# EAGLE schematic MotorShield (EAGLE 9.0.1)

## Sheet 1 of 2
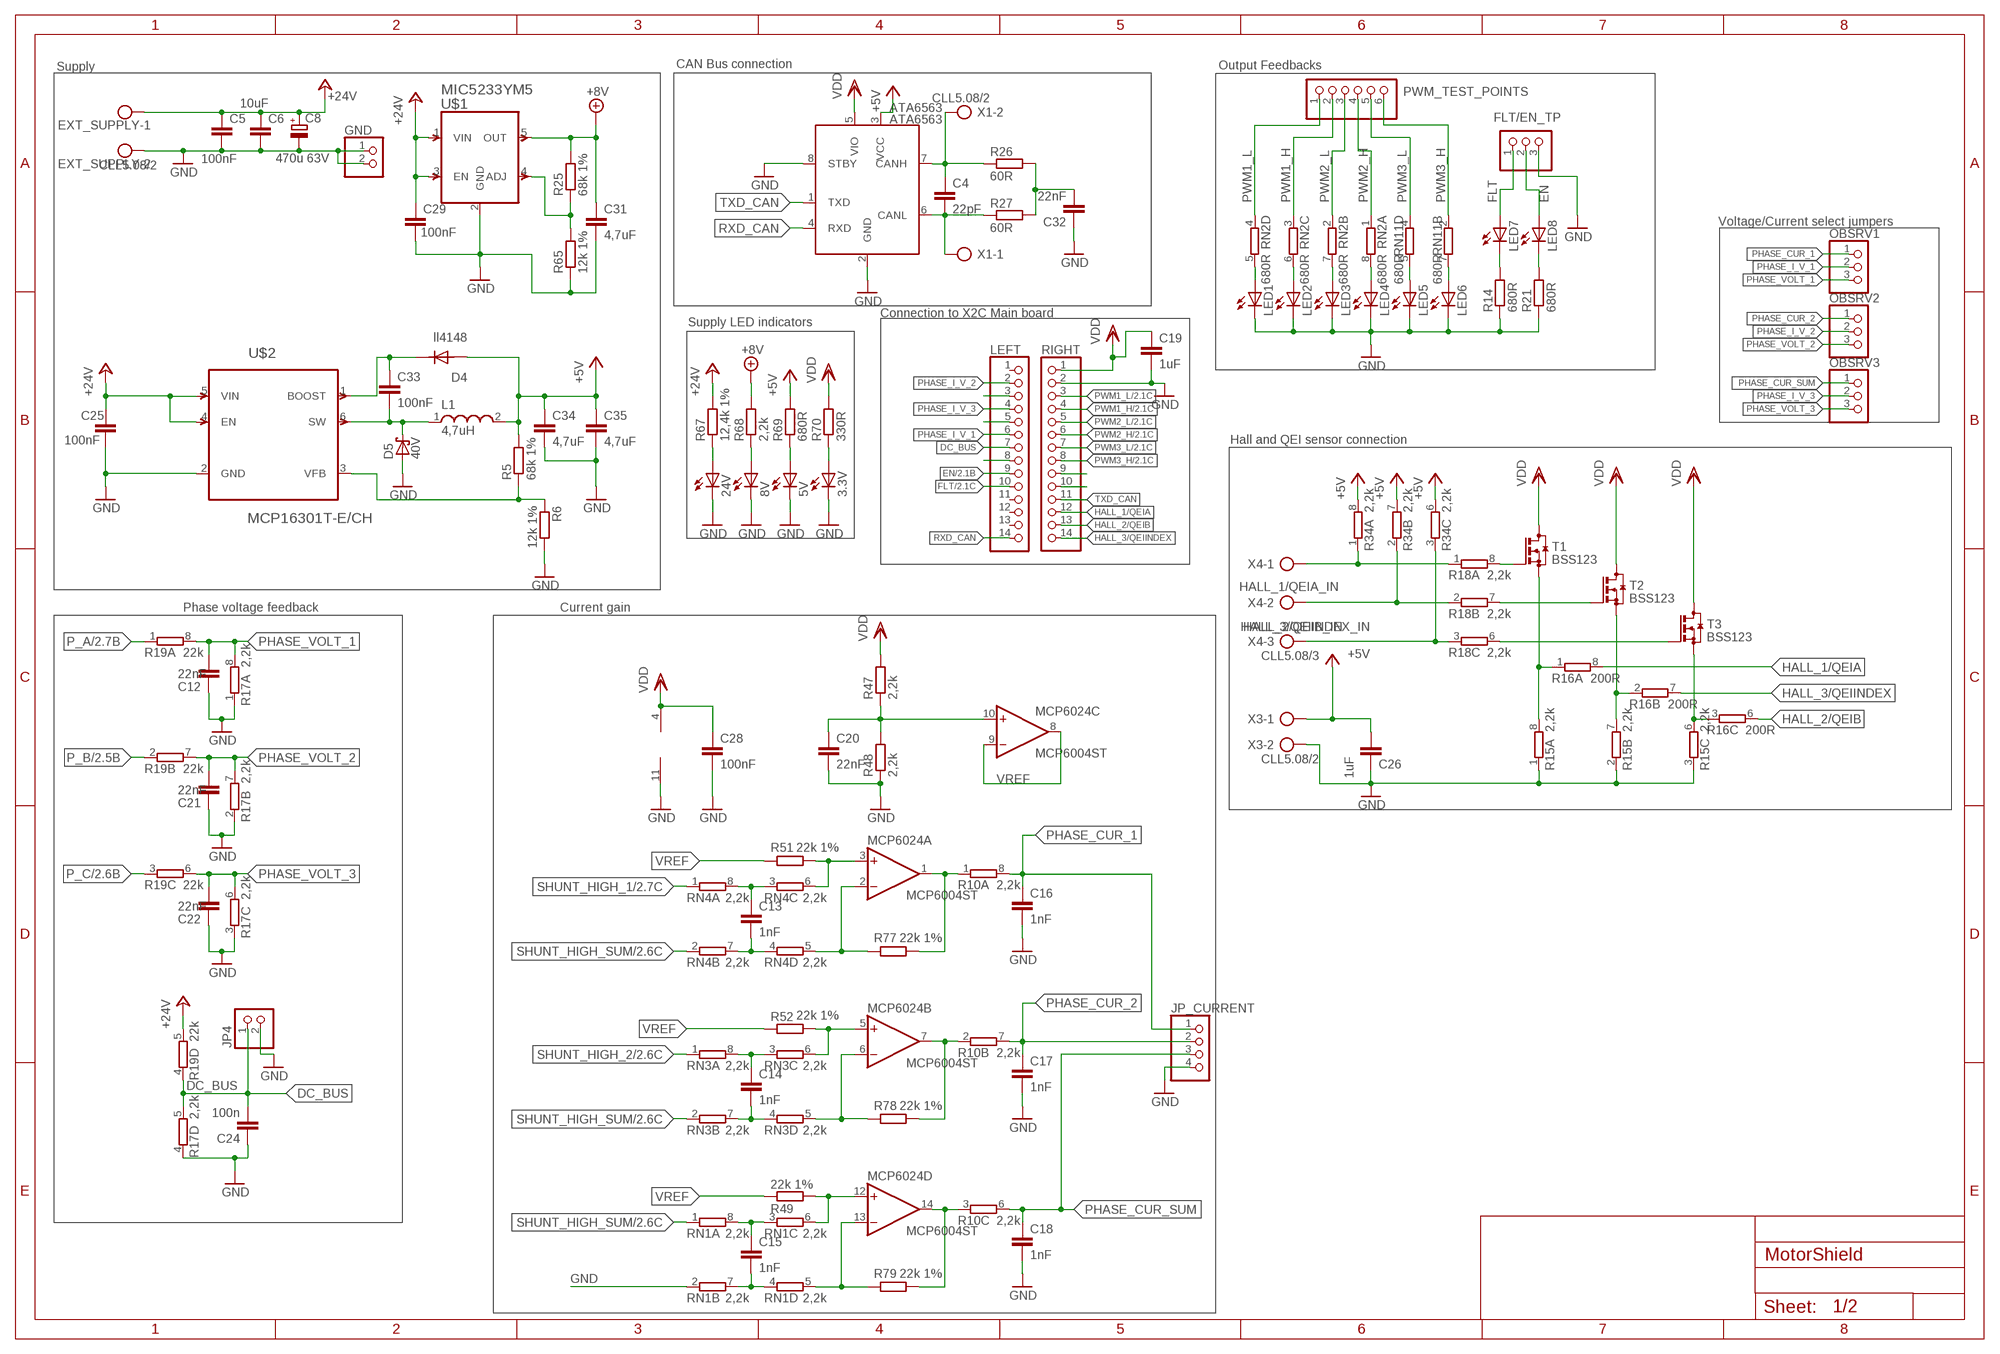
[diagram p0: schematic, sheet 1]

### Parts
3.3V  Green  LEDCHIPLED_0805_GREEN  [CHIPLED_0805]
5V  Green  LEDCHIPLED_0805_GREEN  [CHIPLED_0805]
8V  Green  LEDCHIPLED_0805_GREEN  [CHIPLED_0805]
24V  Green  LEDCHIPLED_0805_GREEN  [CHIPLED_0805]
ATA6563  ATA6563  [SOIC-8]
C4  22pF  C-EU-SMD_0603_22PF_50V  [C0603K]
C5  100nF  C-EU-SMD_0603_100NF_50V  [C0603K]
C6  10uF  C-EU-SMD_1206_10UF_50V  [C1206]
C8  470u 63V  CPOL-EUE  [PANASONIC_E]
C12  22nF  C-EU-SMD_0603_22NF_16V  [C0603K]
C13  1nF  C-EU-SMD_0603_1NF_100V  [C0603K]
C14  1nF  C-EU-SMD_0603_1NF_100V  [C0603K]
C15  1nF  C-EU-SMD_0603_1NF_100V  [C0603K]
C16  1nF  C-EU-SMD_0603_1NF_100V  [C0603K]
C17  1nF  C-EU-SMD_0603_1NF_100V  [C0603K]
C18  1nF  C-EU-SMD_0603_1NF_100V  [C0603K]
C19  1uF  C-EU-SMD_0603_1UF_10V  [C0603K]
C20  22nF  C-EU-SMD_0603_22NF_16V  [C0603K]
C21  22nF  C-EU-SMD_0603_22NF_16V  [C0603K]
C22  22nF  C-EU-SMD_0603_22NF_16V  [C0603K]
C24  100n  C-EUC0805  [C0805]
C25  100nF  C-EU-SMD_0603_100NF_50V  [C0603K]
C26  1uF  C-EU-SMD_0603_1UF_10V  [C0603K]
C28  100nF  C-EU-SMD_0603_100NF_50V  [C0603K]
C29  100nF  C-EU-SMD_0603_100NF_50V  [C0603K]
C31  4,7uF  C-EU-SMD_0603_4,7UF_16V  [C0603K]
C32  22nF  C-EU-SMD_0603_22NF_16V  [C0603K]
C33  100nF  C-EU-SMD_0603_100NF_50V  [C0603K]
C34  4,7uF  C-EU-SMD_0603_4,7UF_16V  [C0603K]
C35  4,7uF  C-EU-SMD_0603_4,7UF_16V  [C0603K]
D4  ll4148  1N4148MINIMELF  [MINIMELF]
D5  40V  SCHOTTKY40V  [MINIMELF]
EXT_SUPPLY  CLL5.08/2  AK500/2CSAVAROS_CLL5.08/2  [CLL5.08/2]
FLT/EN_TP  PINHD-1X3  [1X03]
GND  PINHD-1X2  [1X02]
JP4  PINHD-1X2  [1X02]
JP_CURRENT  PINHD-1X4  [1X04]
L1  4,7uH  WE-TPC_3816_4,7UH_0,9A  [WE-TPC_3816]
LED1  Yellow  LEDCHIPLED_0805_YELLOW  [CHIPLED_0805]
LED2  Yellow  LEDCHIPLED_0805_YELLOW  [CHIPLED_0805]
LED3  Yellow  LEDCHIPLED_0805_YELLOW  [CHIPLED_0805]
LED4  Yellow  LEDCHIPLED_0805_YELLOW  [CHIPLED_0805]
LED5  Yellow  LEDCHIPLED_0805_YELLOW  [CHIPLED_0805]
LED6  Yellow  LEDCHIPLED_0805_YELLOW  [CHIPLED_0805]
LED7  Red  LEDCHIPLED_0805_RED  [CHIPLED_0805]
LED8  Red  LEDCHIPLED_0805_RED  [CHIPLED_0805]
LEFT  PINHD-1X14  [1X14]
MCP6024  MCP6004ST  [TSSOP14]
OBSRV1  PINHD-1X3  [1X03]
OBSRV2  PINHD-1X3  [1X03]
OBSRV3  PINHD-1X3  [1X03]
PWM_TEST_POINTS  PINHD-1X6  [1X06]
R5  68k 1%  R-EU_SMDR0603_68K_1%  [R0603]
R6  12k 1%  R-EU_SMDR0603_12K_1%  [R0603]
R10  2,2k  4R-N2,2K  [EXBV8V_A]
R14  680R  R-EU_SMDR0603_680R  [R0603]
R15  2,2k  4R-N2,2K  [EXBV8V_A]
R16  200R  4R-N200R  [EXBV8V_A]
R17  2,2k  4R-N2,2K  [EXBV8V_A]
R18  2,2k  4R-N2,2K  [EXBV8V_A]
R19  22k  4R-N22K  [EXBV8V_A]
R21  680R  R-EU_SMDR0603_680R  [R0603]
R25  68k 1%  R-EU_SMDR0603_68K_1%  [R0603]
R26  60R  R-EU_SMDR1206_60R  [R1206]
R27  60R  R-EU_SMDR1206_60R  [R1206]
R34  2,2k  4R-N2,2K  [EXBV8V_A]
R47  2,2k  R-EU_SMDR0603_2,2K  [R0603]
R48  2,2k  R-EU_SMDR0603_2,2K  [R0603]
R49  22k 1%  R-EU_SMDR0603_22K_1%  [R0603]
R51  22k 1%  R-EU_SMDR0603_22K_1%  [R0603]
R52  22k 1%  R-EU_SMDR0603_22K_1%  [R0603]
R65  12k 1%  R-EU_SMDR0603_12K_1%  [R0603]
R67  12,4k 1%  R-EU_SMDR0603_12,4K_1%  [R0603]
R68  2,2k  R-EU_SMDR0603_2,2K  [R0603]
R69  680R  R-EU_SMDR0603_680R  [R0603]
R70  330R  R-EU_SMDR0603_330R  [R0603]
R77  22k 1%  R-EU_SMDR0603_22K_1%  [R0603]
R78  22k 1%  R-EU_SMDR0603_22K_1%  [R0603]
R79  22k 1%  R-EU_SMDR0603_22K_1%  [R0603]
RIGHT  PINHD-1X14  [1X14]
RN1  2,2k  4R-N2,2K  [EXBV8V_A]
RN2  680R  4R-N680R  [EXBV8V_A]
RN3  2,2k  4R-N2,2K  [EXBV8V_A]
RN4  2,2k  4R-N2,2K  [EXBV8V_A]
RN11  680R  4R-N680R  [EXBV8V_A]
T1  BSS123  [SOT23]
T2  BSS123  [SOT23]
T3  BSS123  [SOT23]
U$1  MIC5233YM5  [TSOT23-5]
U$2  MCP16301T-E/CH  [SOT23-6]
X1  CLL5.08/2  AK500/2CSAVAROS_CLL5.08/2  [CLL5.08/2]
X3  CLL5.08/2  AK500/2CSAVAROS_CLL5.08/2  [CLL5.08/2]
X4  CLL5.08/3  AK500/3CSAVAROS_CLL5.08/3  [CLL5.08/3]

### Nets
+5V: ATA6563.3(VCC) C26.1 C34.1 C35.1 D4.A L1.2 R5.2 R34.6 R34.7 R34.8 R69.2 X3.1
+8V: C31.1 R25.2 R68.2 U$1.5(OUT) ; also sheet 2
+24V: C5.1 C6.1 C8.+ C25.1 C29.1 EXT_SUPPLY.1 R19.5 R67.2 U$1.1(VIN) U$1.3(EN) U$2.4(EN) U$2.5(VIN) ; also sheet 2
CAN_H: ATA6563.7(CANH) C4.1 R26.1 X1.2
CAN_L: ATA6563.6(CANL) C4.2 R27.1 X1.1
DC_BUS: C24.2 JP4.1 LEFT.7 R17.5 R19.4
EN: FLT/EN_TP.2 LED8.A LEFT.9 ; also sheet 2
FLT: FLT/EN_TP.1 LED7.A LEFT.10 ; also sheet 2
GND: 3.3V.C 5V.C 8V.C 24V.C ATA6563.2(GND) ATA6563.8(STBY) C5.2 C6.2 C8.- C12.2 C16.2 C17.2 C18.2 C19.2 C20.2 C21.2 C22.2 C24.1 C25.2 C26.2 C28.2 C29.2 C31.2 C32.1 C34.2 C35.2 D5.A EXT_SUPPLY.2 FLT/EN_TP.3 GND.1 GND.2 JP4.2 JP_CURRENT.4 LED1.C LED2.C LED3.C LED4.C LED5.C LED6.C MCP6024.11(P:V-) R6.2 R14.1 R15.1 R15.2 R15.3 R17.1 R17.2 R17.3 R17.4 R21.1 R48.1 R65.1 RIGHT.2 RN1.2 U$1.2(GND) U$2.2(GND) X3.2 ; also sheet 2
HALL_1/QEIA: R16.8 RIGHT.12
HALL_1/QEIA_IN: R18.1 R34.1 X4.1
HALL_2/QEIB: R16.6 RIGHT.13
HALL_2/QEIB_IN: R18.3 R34.3 X4.3
HALL_3/QEIINDEX: R16.7 RIGHT.14
HALL_3/QEIINDEX_IN: R18.2 R34.2 X4.2
N$2: MCP6024.3(A:+IN) R51.2 RN4.6
N$3: MCP6024.14(D:OUT) R10.3 R79.2
N$4: MCP6024.7(B:OUT) R10.2 R78.2
N$5: LEFT.3
N$6: LED8.C R21.2
N$7: LEFT.5
N$8: LED7.C R14.2
N$9: MCP6024.5(B:+IN) R52.2 RN3.6
N$10: RIGHT.9
N$11: RIGHT.10
N$12: C33.2 D5.C L1.1 U$2.6(SW)
N$13: LEFT.8
N$14: R25.1 R65.2 U$1.4(ADJ)
N$15: MCP6024.12(D:+IN) R49.2 RN1.6
N$16: R15.6 R16.3 T3.2(S)
N$17: R15.7 R16.2 T2.2(S)
N$18: R15.8 R16.1 T1.2(S)
N$19: R18.8 T1.1(G)
N$20: R18.7 T2.1(G)
N$23: R18.6 T3.1(G)
N$24: LED4.A RN2.8
N$25: LED3.A RN2.7
N$26: LED2.A RN2.6
N$27: 24V.A R67.1
N$28: 8V.A R68.1
N$30: 5V.A R69.1
N$31: 3.3V.A R70.1
N$33: C13.2 RN4.4 RN4.7
N$34: C13.1 RN4.3 RN4.8
N$35: MCP6024.2(A:-IN) R77.1 RN4.5
N$36: LED1.A RN2.5
N$37: C14.2 RN3.4 RN3.7
N$38: C14.1 RN3.3 RN3.8
N$39: LED5.A RN11.5
N$40: LED6.A RN11.7
N$44: R5.1 R6.1 U$2.3(VFB)
N$45: MCP6024.6(B:-IN) R78.1 RN3.5
N$47: C15.2 RN1.4 RN1.7
N$48: C15.1 RN1.3 RN1.8
N$49: MCP6024.13(D:-IN) R79.1 RN1.5
N$52: C33.1 D4.C U$2.1(BOOST)
N$56: C32.2 R26.2 R27.2
N$60: MCP6024.1(A:OUT) R10.1 R77.2
N$66: C20.1 MCP6024.10(C:+IN) R47.1 R48.2
P_A: R19.1 ; also sheet 2
P_B: R19.2 ; also sheet 2
P_C: R19.3 ; also sheet 2
PHASE_CUR_1: C16.1 JP_CURRENT.1 OBSRV1.1 R10.8
PHASE_CUR_2: C17.1 JP_CURRENT.2 OBSRV2.1 R10.7
PHASE_CUR_SUM: C18.1 JP_CURRENT.3 OBSRV3.1 R10.6
PHASE_I_V_1: LEFT.6 OBSRV1.2
PHASE_I_V_2: LEFT.2 OBSRV2.2
PHASE_I_V_3: LEFT.4 OBSRV3.2
PHASE_VOLT_1: C12.1 OBSRV1.3 R17.8 R19.8
PHASE_VOLT_2: C21.1 OBSRV2.3 R17.7 R19.7
PHASE_VOLT_3: C22.1 OBSRV3.3 R17.6 R19.6
PWM1_H: PWM_TEST_POINTS.2 RIGHT.4 RN2.3 ; also sheet 2
PWM1_L: PWM_TEST_POINTS.1 RIGHT.3 RN2.4 ; also sheet 2
PWM2_H: PWM_TEST_POINTS.4 RIGHT.6 RN2.1 ; also sheet 2
PWM2_L: PWM_TEST_POINTS.3 RIGHT.5 RN2.2 ; also sheet 2
PWM3_H: PWM_TEST_POINTS.6 RIGHT.8 RN11.2 ; also sheet 2
PWM3_L: PWM_TEST_POINTS.5 RIGHT.7 RN11.4 ; also sheet 2
RXD_CAN: ATA6563.4(RXD) LEFT.14
SHUNT_HIGH_1: RN4.1 ; also sheet 2
SHUNT_HIGH_2: RN3.1 ; also sheet 2
SHUNT_HIGH_SUM: RN1.1 RN3.2 RN4.2 ; also sheet 2
TXD_CAN: ATA6563.1(TXD) RIGHT.11
VDD: ATA6563.5(VIO) C19.1 C28.1 MCP6024.4(P:V+) R47.2 R70.2 RIGHT.1 T1.3(D) T2.3(D) T3.3(D) ; also sheet 2
VREF: MCP6024.8(C:OUT) MCP6024.9(C:-IN) R49.1 R51.1 R52.1
Unconnected: LEFT.1 LEFT.11 LEFT.12 LEFT.13 R10.4 R10.5 R15.4 R15.5 R16.4 R16.5 R18.4 R18.5 R34.4 R34.5 RN11.1 RN11.3 RN11.6 RN11.8

### Notes on the sheet
- Supply | CAN Bus connection | Output Feedbacks
- Voltage/Current select jumpers
- Connection to X2C Main board
- Supply LED indicators
- Hall and QEI sensor connection
- Phase voltage feedback | Current gain

## Sheet 2 of 2
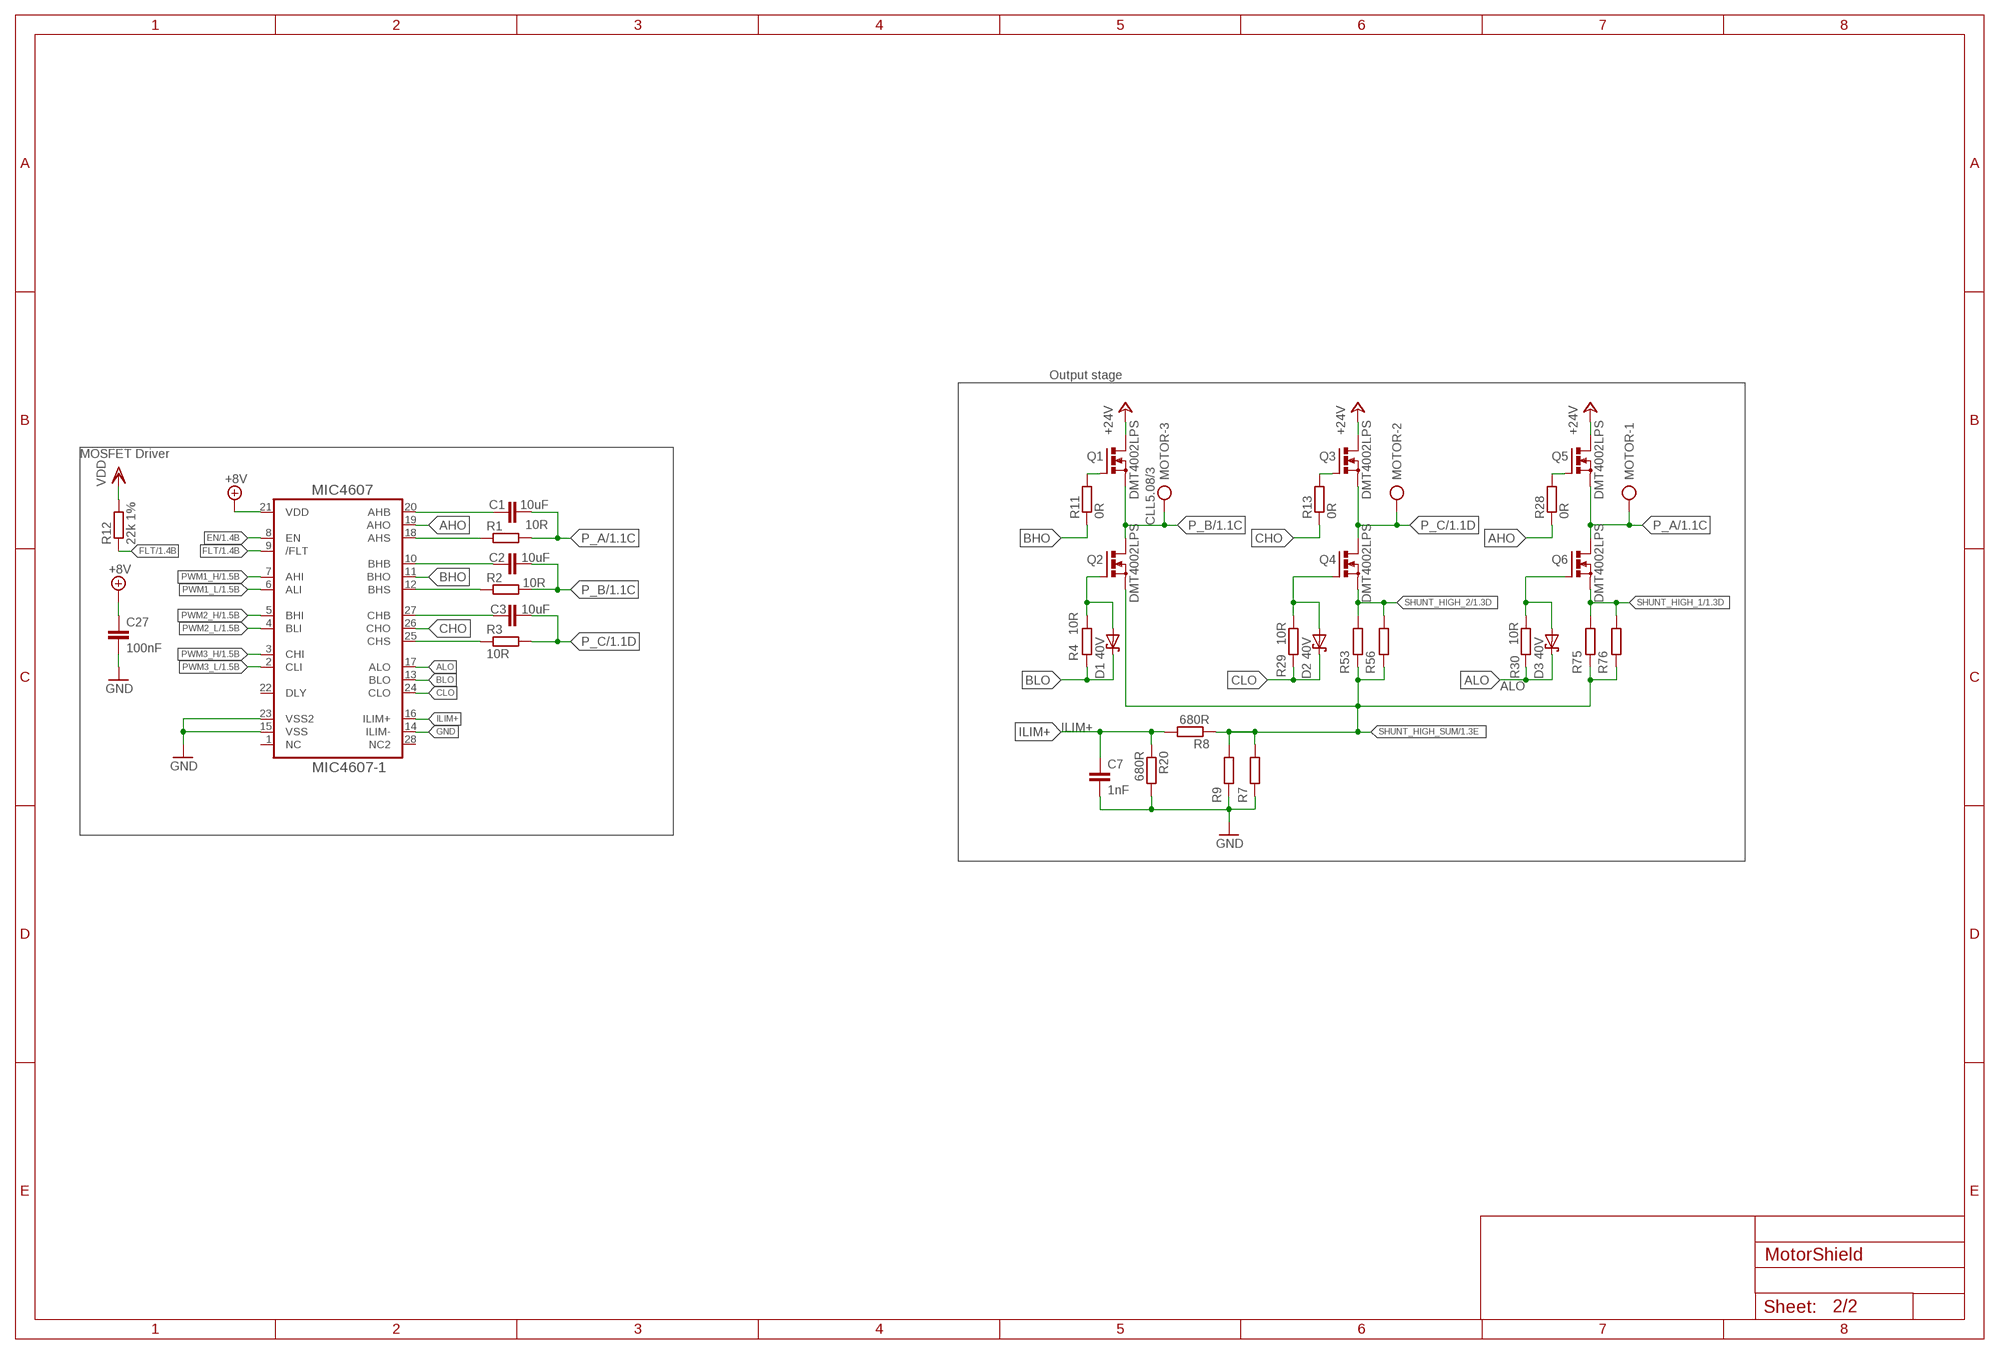
[diagram p1: schematic, sheet 2]

### Parts
C1  10uF  C-EU-SMD_0805_10UF_16V  [C0805K]
C2  10uF  C-EU-SMD_0805_10UF_16V  [C0805K]
C3  10uF  C-EU-SMD_0805_10UF_16V  [C0805K]
C7  1nF  C-EU-SMD_0603_1NF_100V  [C0603K]
C27  100nF  C-EU-SMD_0603_100NF_50V  [C0603K]
D1  40V  SCHOTTKY40V  [MINIMELF]
D2  40V  SCHOTTKY40V  [MINIMELF]
D3  40V  SCHOTTKY40V  [MINIMELF]
MIC4607  MIC4607-1  [TSSOP28]
MOTOR  CLL5.08/3  AK500/3CSAVAROS_CLL5.08/3  [CLL5.08/3]
Q1  DMT4002LPS  BSZ105N04NS_PG-TDSON-8  [PG-TDSON-8_]
Q2  DMT4002LPS  BSZ105N04NS_PG-TDSON-8  [PG-TDSON-8_]
Q3  DMT4002LPS  BSZ105N04NS_PG-TDSON-8  [PG-TDSON-8_]
Q4  DMT4002LPS  BSZ105N04NS_PG-TDSON-8  [PG-TDSON-8_]
Q5  DMT4002LPS  BSZ105N04NS_PG-TDSON-8  [PG-TDSON-8_]
Q6  DMT4002LPS  BSZ105N04NS_PG-TDSON-8  [PG-TDSON-8_]
R1  10R  R-EU_SMDR0603_3R  [R0603]
R2  10R  R-EU_SMDR0603_3R  [R0603]
R3  10R  R-EU_SMDR0603_3R  [R0603]
R4  10R  R-EU_SMDR0603_3R  [R0603]
R7  R-EU_SMDR2512  [R2512]
R8  680R  R-EU_SMDR0603_680R  [R0603]
R9  R-EU_SMDR2512  [R2512]
R11  0R  R-EU_SMDR0603_0R  [R0603]
R12  22k 1%  R-EU_SMDR0603_22K_1%  [R0603]
R13  0R  R-EU_SMDR0603_0R  [R0603]
R20  680R  R-EU_SMDR0603_680R  [R0603]
R28  0R  R-EU_SMDR0603_0R  [R0603]
R29  10R  R-EU_SMDR0603_3R  [R0603]
R30  10R  R-EU_SMDR0603_3R  [R0603]
R53  R-EU_SMDR2512  [R2512]
R56  R-EU_SMDR2512  [R2512]
R75  R-EU_SMDR2512  [R2512]
R76  R-EU_SMDR2512  [R2512]

### Nets
+8V: C27.1 MIC4607.21(VDD) ; also sheet 1
+24V: Q1.5(D) Q1.6(D) Q1.7(D) Q1.8(D) Q1.TH(D) Q3.5(D) Q3.6(D) Q3.7(D) Q3.8(D) Q3.TH(D) Q5.5(D) Q5.6(D) Q5.7(D) Q5.8(D) Q5.TH(D) ; also sheet 1
AHB: C1.1 MIC4607.20(AHB)
AHO: MIC4607.19(AHO) R28.1
AHS: MIC4607.18(AHS) R1.1
ALO: D3.C MIC4607.17(ALO) R30.2
BHB: C2.1 MIC4607.10(BHB)
BHO: MIC4607.11(BHO) R11.1
BHS: MIC4607.12(BHS) R2.1
BLO: D1.C MIC4607.13(BLO) R4.1
CHB: C3.1 MIC4607.27(CHB)
CHO: MIC4607.26(CHO) R13.1
CHS: MIC4607.25(CHS) R3.1
CLO: D2.C MIC4607.24(CLO) R29.2
EN: MIC4607.8(EN) ; also sheet 1
FLT: MIC4607.9(/FLT) R12.1 ; also sheet 1
GND: C7.2 C27.2 MIC4607.14(ILIM-) MIC4607.15(VSS) MIC4607.23(VSS2) R7.1 R9.1 R20.2 ; also sheet 1
ILIM+: C7.1 MIC4607.16(ILIM+) R8.2 R20.1
N$1: Q1.4(G) R11.2
N$21: Q3.4(G) R13.2
N$22: Q5.4(G) R28.2
N$29: D1.A Q2.4(G) R4.2
N$32: D2.A Q4.4(G) R29.1
N$58: D3.A Q6.4(G) R30.1
P_A: C1.2 MOTOR.1 Q5.1(S) Q5.2(S) Q5.3(S) Q6.5(D) Q6.6(D) Q6.7(D) Q6.8(D) Q6.TH(D) R1.2 ; also sheet 1
P_B: C2.2 MOTOR.3 Q1.1(S) Q1.2(S) Q1.3(S) Q2.5(D) Q2.6(D) Q2.7(D) Q2.8(D) Q2.TH(D) R2.2 ; also sheet 1
P_C: C3.2 MOTOR.2 Q3.1(S) Q3.2(S) Q3.3(S) Q4.5(D) Q4.6(D) Q4.7(D) Q4.8(D) Q4.TH(D) R3.2 ; also sheet 1
PWM1_H: MIC4607.7(AHI) ; also sheet 1
PWM1_L: MIC4607.6(ALI) ; also sheet 1
PWM2_H: MIC4607.5(BHI) ; also sheet 1
PWM2_L: MIC4607.4(BLI) ; also sheet 1
PWM3_H: MIC4607.3(CHI) ; also sheet 1
PWM3_L: MIC4607.2(CLI) ; also sheet 1
SHUNT_HIGH_1: Q6.1(S) Q6.2(S) Q6.3(S) R75.2 R76.2 ; also sheet 1
SHUNT_HIGH_2: Q4.1(S) Q4.2(S) Q4.3(S) R53.2 R56.2 ; also sheet 1
SHUNT_HIGH_SUM: Q2.1(S) Q2.2(S) Q2.3(S) R7.2 R8.1 R9.2 R53.1 R56.1 R75.1 R76.1 ; also sheet 1
VDD: R12.2 ; also sheet 1
Unconnected: MIC4607.1(NC) MIC4607.22(DLY) MIC4607.28(NC2)

### Notes on the sheet
- Output stage
- MOSFET Driver

## Library data of the parts
3.3V 5V 8V 24V = Diodes:LED: LED OSRAM: - CHIPLED LG R971, LG N971, LY N971, LG Q971, LY Q971, LO R971, LY R971 LH N974, LH R974 LS Q976, LO Q976, LY Q976 LO Q996 - Hyper CHIPLED LW Q18S LB Q993, LB Q99A, LB R99A - SideLED LS A670, LO A670, LY A670, LG A670, LP A670 LB A673, LV A673, LT A673, LW A673 LH A674 LY A675 LS A676, LA A676, LO A676, LY A676, LW A676 LS A679, LY A679, LG A679 - Hyper Micro SIDELED® LS Y876, LA Y876, LO Y876, LY Y876 LT Y87S - SmartLED LW L88C, LW L88S LB L89C, LB L89S, LG L890 LS L89K, LO L89K, LY L89K LS L896, LA L896, LO L896, LY L896 - TOPLED LS T670, LO T670, LY T670, LG T670, LP T670 LSG T670, LSP T670, LSY T670, LOP T670, LYG T670 LG T671, LOG T671, LSG T671 LB T673, LV T673, LT T673, LW T673 LH T674 LS T676, LA T676, LO T676, LY T676, LB T676, LH T676, LSB T676, LW T676 LB T67C, LV T67C, LT T67C, LS T67K, LO T67K, LY T67K, LW E67C LS E67B, LA E67B, LO E67B, LY E67B, LB E67C, LV E67C, LT E67C LW T67C LS T679, LY T679, LG T679 LS T770, LO T770, LY T770, LG T770, LP T770 LB T773, LV T773, LT T773, LW T773 LH T774 LS E675, LA E675, LY E675, LS T675 LS T776, LA T776, LO T776, LY T776, LB T776 LHGB T686 LT T68C, LB T68C - Hyper Mini TOPLED® LB M676 - Mini TOPLED Santana® LG M470 LS M47K, LO M47K, LY M47K Source: http://www.osram.convergy.de LUXEON: - LUMILED® LXK2-PW12-R00, LXK2-PW12-S00, LXK2-PW14-U00, LXK2-PW14-V00 LXK2-PM12-R00, LXK2-PM12-S00, LXK2-PM14-U00 LXK2-PE12-Q00, LXK2-PE12-R00, LXK2-PE12-S00, LXK2-PE14-T00, LXK2-PE14-U00 LXK2-PB12-K00, LXK2-PB12-L00, LXK2-PB12-M00, LXK2-PB14-N00, LXK2-PB14-P00, LXK2-PB14-Q00 LXK2-PR12-L00, LXK2-PR12-M00, LXK2-PR14-Q00, LXK2-PR14-R00 LXK2-PD12-Q00, LXK2-PD12-R00, LXK2-PD12-S00 LXK2-PH12-R00, LXK2-PH12-S00 LXK2-PL12-P00, LXK2-PL12-Q00, LXK2-PL12-R00 Source: www.luxeon.com KINGBRIGHT: KA-3528ASYC Source: www.kingbright.com; EAGLEID: 1109
ATA6563 = MCHP_Egyeb_Kando:ATA6563
C1-C3 = C_EU_Kando:C-EU-SMD: CAPACITOR, European symbol; EAGLEID: 1275
C4 = C_EU_Kando:C-EU-SMD: CAPACITOR, European symbol; EAGLEID: 1312
C5 C25 C27-C29 C33 = C_EU_Kando:C-EU-SMD: CAPACITOR, European symbol; EAGLEID: 1204
C6 = C_EU_Kando:C-EU-SMD: CAPACITOR, European symbol; EAGLEID: 1368
C7 C13-C18 = C_EU_Kando:C-EU-SMD: CAPACITOR, European symbol
C8 = C_EU_Kando:CPOL-EU: POLARIZED CAPACITOR, European symbol; SPICEPREFIX: C
C12 C20-C22 C32 = C_EU_Kando:C-EU-SMD: CAPACITOR, European symbol; EAGLEID: 1311
C19 C26 = C_EU_Kando:C-EU-SMD: CAPACITOR, European symbol; EAGLEID: 1309
C24 = rcl:C-EU: CAPACITOR, European symbol; SPICEPREFIX: C
C31 C34 C35 = C_EU_Kando:C-EU-SMD: CAPACITOR, European symbol; EAGLEID: 1310
D1-D3 D5 = Diodes:SCHOTTKY: Schottky Diode; TME: TMMBAT48FILM
D4 = Diodes:1N4148: DIODE Generic diode; EAGLEID: 1075; TME: DL4148
EXT_SUPPLY X1 X3 = CONNECTORS:AK500/2: CONNECTOR csavaros csapsorléc; EAGLEID: 1029
FLT/EN_TP OBSRV1-OBSRV3 = CONNECTORS:PINHD-1X3: PIN HEADER
GND JP4 = CONNECTORS:PINHD-1X2: PIN HEADER
JP_CURRENT = CONNECTORS:PINHD-1X4: PIN HEADER
L1 = Coils_Kando:WE-TPC: SMD Shielded Tiny Power Inductor Characteristics Extremely flat power inductor High current capability Magnetically shielded which results in a low leakage field Operating temperature: –40 °C to +125 °C Applications Portable power like PDA, digital camera, PCMCIA cards and displays DC/DC converter Embedded PC Mobile data gathering, telemetric <http://katalog.we-online.de/media/images/eisos/IndTPC_pf2.jpg> Details see: http://katalog.we-online.de/en/pbs/WE-TPC? Updated by Dan Xu 2014-07-11 2014 (C) Wurth Elektronik
LED1-LED6 = Diodes:LED: LED OSRAM: - CHIPLED LG R971, LG N971, LY N971, LG Q971, LY Q971, LO R971, LY R971 LH N974, LH R974 LS Q976, LO Q976, LY Q976 LO Q996 - Hyper CHIPLED LW Q18S LB Q993, LB Q99A, LB R99A - SideLED LS A670, LO A670, LY A670, LG A670, LP A670 LB A673, LV A673, LT A673, LW A673 LH A674 LY A675 LS A676, LA A676, LO A676, LY A676, LW A676 LS A679, LY A679, LG A679 - Hyper Micro SIDELED® LS Y876, LA Y876, LO Y876, LY Y876 LT Y87S - SmartLED LW L88C, LW L88S LB L89C, LB L89S, LG L890 LS L89K, LO L89K, LY L89K LS L896, LA L896, LO L896, LY L896 - TOPLED LS T670, LO T670, LY T670, LG T670, LP T670 LSG T670, LSP T670, LSY T670, LOP T670, LYG T670 LG T671, LOG T671, LSG T671 LB T673, LV T673, LT T673, LW T673 LH T674 LS T676, LA T676, LO T676, LY T676, LB T676, LH T676, LSB T676, LW T676 LB T67C, LV T67C, LT T67C, LS T67K, LO T67K, LY T67K, LW E67C LS E67B, LA E67B, LO E67B, LY E67B, LB E67C, LV E67C, LT E67C LW T67C LS T679, LY T679, LG T679 LS T770, LO T770, LY T770, LG T770, LP T770 LB T773, LV T773, LT T773, LW T773 LH T774 LS E675, LA E675, LY E675, LS T675 LS T776, LA T776, LO T776, LY T776, LB T776 LHGB T686 LT T68C, LB T68C - Hyper Mini TOPLED® LB M676 - Mini TOPLED Santana® LG M470 LS M47K, LO M47K, LY M47K Source: http://www.osram.convergy.de LUXEON: - LUMILED® LXK2-PW12-R00, LXK2-PW12-S00, LXK2-PW14-U00, LXK2-PW14-V00 LXK2-PM12-R00, LXK2-PM12-S00, LXK2-PM14-U00 LXK2-PE12-Q00, LXK2-PE12-R00, LXK2-PE12-S00, LXK2-PE14-T00, LXK2-PE14-U00 LXK2-PB12-K00, LXK2-PB12-L00, LXK2-PB12-M00, LXK2-PB14-N00, LXK2-PB14-P00, LXK2-PB14-Q00 LXK2-PR12-L00, LXK2-PR12-M00, LXK2-PR14-Q00, LXK2-PR14-R00 LXK2-PD12-Q00, LXK2-PD12-R00, LXK2-PD12-S00 LXK2-PH12-R00, LXK2-PH12-S00 LXK2-PL12-P00, LXK2-PL12-Q00, LXK2-PL12-R00 Source: www.luxeon.com KINGBRIGHT: KA-3528ASYC Source: www.kingbright.com; EAGLEID: 1112
LED7 LED8 = Diodes:LED: LED OSRAM: - CHIPLED LG R971, LG N971, LY N971, LG Q971, LY Q971, LO R971, LY R971 LH N974, LH R974 LS Q976, LO Q976, LY Q976 LO Q996 - Hyper CHIPLED LW Q18S LB Q993, LB Q99A, LB R99A - SideLED LS A670, LO A670, LY A670, LG A670, LP A670 LB A673, LV A673, LT A673, LW A673 LH A674 LY A675 LS A676, LA A676, LO A676, LY A676, LW A676 LS A679, LY A679, LG A679 - Hyper Micro SIDELED® LS Y876, LA Y876, LO Y876, LY Y876 LT Y87S - SmartLED LW L88C, LW L88S LB L89C, LB L89S, LG L890 LS L89K, LO L89K, LY L89K LS L896, LA L896, LO L896, LY L896 - TOPLED LS T670, LO T670, LY T670, LG T670, LP T670 LSG T670, LSP T670, LSY T670, LOP T670, LYG T670 LG T671, LOG T671, LSG T671 LB T673, LV T673, LT T673, LW T673 LH T674 LS T676, LA T676, LO T676, LY T676, LB T676, LH T676, LSB T676, LW T676 LB T67C, LV T67C, LT T67C, LS T67K, LO T67K, LY T67K, LW E67C LS E67B, LA E67B, LO E67B, LY E67B, LB E67C, LV E67C, LT E67C LW T67C LS T679, LY T679, LG T679 LS T770, LO T770, LY T770, LG T770, LP T770 LB T773, LV T773, LT T773, LW T773 LH T774 LS E675, LA E675, LY E675, LS T675 LS T776, LA T776, LO T776, LY T776, LB T776 LHGB T686 LT T68C, LB T68C - Hyper Mini TOPLED® LB M676 - Mini TOPLED Santana® LG M470 LS M47K, LO M47K, LY M47K Source: http://www.osram.convergy.de LUXEON: - LUMILED® LXK2-PW12-R00, LXK2-PW12-S00, LXK2-PW14-U00, LXK2-PW14-V00 LXK2-PM12-R00, LXK2-PM12-S00, LXK2-PM14-U00 LXK2-PE12-Q00, LXK2-PE12-R00, LXK2-PE12-S00, LXK2-PE14-T00, LXK2-PE14-U00 LXK2-PB12-K00, LXK2-PB12-L00, LXK2-PB12-M00, LXK2-PB14-N00, LXK2-PB14-P00, LXK2-PB14-Q00 LXK2-PR12-L00, LXK2-PR12-M00, LXK2-PR14-Q00, LXK2-PR14-R00 LXK2-PD12-Q00, LXK2-PD12-R00, LXK2-PD12-S00 LXK2-PH12-R00, LXK2-PH12-S00 LXK2-PL12-P00, LXK2-PL12-Q00, LXK2-PL12-R00 Source: www.luxeon.com KINGBRIGHT: KA-3528ASYC Source: www.kingbright.com; EAGLEID: 1110
LEFT RIGHT = pinhead:PINHD-1X14: PIN HEADER
MCP6024 = MCHP_Egyeb_Kando:MCP6004: Quad Op Amp 2.7V to 6.0V Single Supply Source: http://www.microchip.com/wwwproducts/en/MCP6004
MIC4607 = MCHP_Egyeb_Kando:MIC4607: Microchip MIC4607 Datasheet <http://www.microchip.com/wwwproducts/en/MIC4607> Gate drive supply voltage up to 16V Overcurrent protection Drives high-side and low-side N-Channel MOSFETs with independent inputs or with a single PWM signal TTL input thresholds On-chip bootstrap diodes Fast 35ns propagation times Shoot-through protection Drives 1000pF load with 20ns rise and fall times Low power consumption The MIC4607 is an 85V, three-phase MOSFET driver. The MIC4607 features a fast (35ns) propagation delay time and 20ns driver rise/fall times for a 1nF capacitive load. TTL inputs can be separate high- and low-side signals or a single PWM input with high and low drive generated internally. High- and low-side outputs are guaranteed to not overlap in either mode. The MIC4607 includes overcurrent protection as well as a high-voltage internal diode that charges the high-side gate drive bootstrap capacitor.A robust, high-speed, and low-power level shifter provides clean level transitions to the high-side output. The robust operation of the MIC4607 ensures that the outputs are not affected by supply glitches, HS ringing below ground, or HS slewing with high-speed voltage transitions. Undervoltage protection is provided on both the low-side and high-side drivers. The MIC4607 is available in a both a 28-pin 4mm x 5mm QFN and 28-pin TSSOP package with an operating junction temperature range of -40°C to +125°C.
MOTOR X4 = CONNECTORS:AK500/3: CONNECTOR csavaros csapsorléc; EAGLEID: 1030
PWM_TEST_POINTS = CONNECTORS:PINHD-1X6: PIN HEADER
Q1-Q6 = Felvezetok:BSZ105N04NS: OptiMOS (TM)3 Power-Transistor N-Channel, Normal level Source : Data sheet <http://www.infineon.com/dgdl/BSZ105N04NSG_rev1.1.pdf?folderId=db3a3043156fd5730115c7d50620107c&fileId=db3a30431689f4420116c485c67f084e>
R1-R4 R29 R30 = R_EU:R-EU_SMD: RESISTOR, European symbol; VALUE: 3R
R5 R25 = R_EU:R-EU_SMD: RESISTOR, European symbol; EAGLEID: 1324
R6 R65 = R_EU:R-EU_SMD: RESISTOR, European symbol; EAGLEID: 1317
R7-R9 R11 R13 R14 R20 R21 R26-R28 R53 R56 R69 R75 R76 = R_EU:R-EU_SMD: RESISTOR, European symbol
R10 R15 R17 R18 R34 RN1 RN3 RN4 = R_EU:4R-N: Array Chip Resistor; EAGLEID: 1022
R12 R49 R51 R52 R77-R79 = R_EU:R-EU_SMD: RESISTOR, European symbol; EAGLEID: 1314
R16 = R_EU:4R-N: Array Chip Resistor; EAGLEID: 1023
R19 = R_EU:4R-N: Array Chip Resistor
R47 R48 R68 = R_EU:R-EU_SMD: RESISTOR, European symbol; EAGLEID: 1364
R67 = R_EU:R-EU_SMD: RESISTOR, European symbol; EAGLEID: 1316
R70 = R_EU:R-EU_SMD: RESISTOR, European symbol; EAGLEID: 1374
RN2 RN11 = R_EU:4R-N: Array Chip Resistor; EAGLEID: 1028
T1-T3 = Felvezetok:BSS123: N-CHANNEL MOS FET; EAGLEID: 1139
U$1 = MCHP_Egyeb_Kando:MIC5233: Microchip MIC5233 <http://www.microchip.com/wwwproducts/en/MIC5233#additional-features> The MIC5233 is a 100mA, highly accurate, low dropout regulator with high input voltage and ultra-low ground current. This combination of high input voltage and low ground current makes the MIC5233 ideal for multi-cell Li-Ion battery systems. A µCap LDO design, the MIC5233 is stable with either ceramic or tantalum output capacitors. It only requires a 2.2µF capacitor for stability. Features of the MIC5233 include enable input, thermal shutdown, current limit, reverse battery protection, and reverse leakage protection. Available in fixed and adjustable output voltage versions, the MIC5233 is offered in the IttyBitty® SOT-23-5 package with a junction temperature range of -40°C to +125°C. Wide input voltage range: 2.3V to 36V Ultra-low ground current: 18µA Low dropout voltage of 270mV at 100mA High output accuracy of ±2.0% over temperature µCap: stable with ceramic or tantalum capacitors Excellent line and load regulation specifications Zero off-mode current Reverse battery protection Reverse leakage protection Thermal shutdown and current limit protection IttyBitty® SOT-23-5 package
U$2 = MCHP_Egyeb_Kando:MCP16301: Microchip Buck regulator MCP16301 <Datasheet: http://www.microchip.com/wwwproducts/en/MCP16301> The MCP16301 is a highly integrated, high-efficiency, fixed frequency, step-down DC-DC converter in a popular 6-pin SOT-23 package that operates from input voltage sources up to 30V. Integrated features include a high side switch, fixed frequency Peak Current Mode Control, internal compensation, peak current limit and overtemperature protection. Minimal external components are necessary to develop a complete step-down DC-DC converter power supply. Features Up to 96% Typical Efficiency Input Voltage Range: 4 to 30 Output Voltage Range: 2.0V to 15V 2% Output Voltage Accuracy Integrated N-Channel Buck Switch 600 mA Output Current 500 kHz Fixed Frequency Adjustable Output Voltage Low Device Shutdown Current Peak Current Mode Control Internal Compensation Stable with Ceramic Capacitors Internal Soft-Start Cycle by Cycle Peak Current Limit Overtemperature Protection SOT-23-6; MCHP_ID: MIC19965